# Altium schematic sheet Sensors.SchDoc
size A4; SheetNumber: 2; SheetTotal: 7
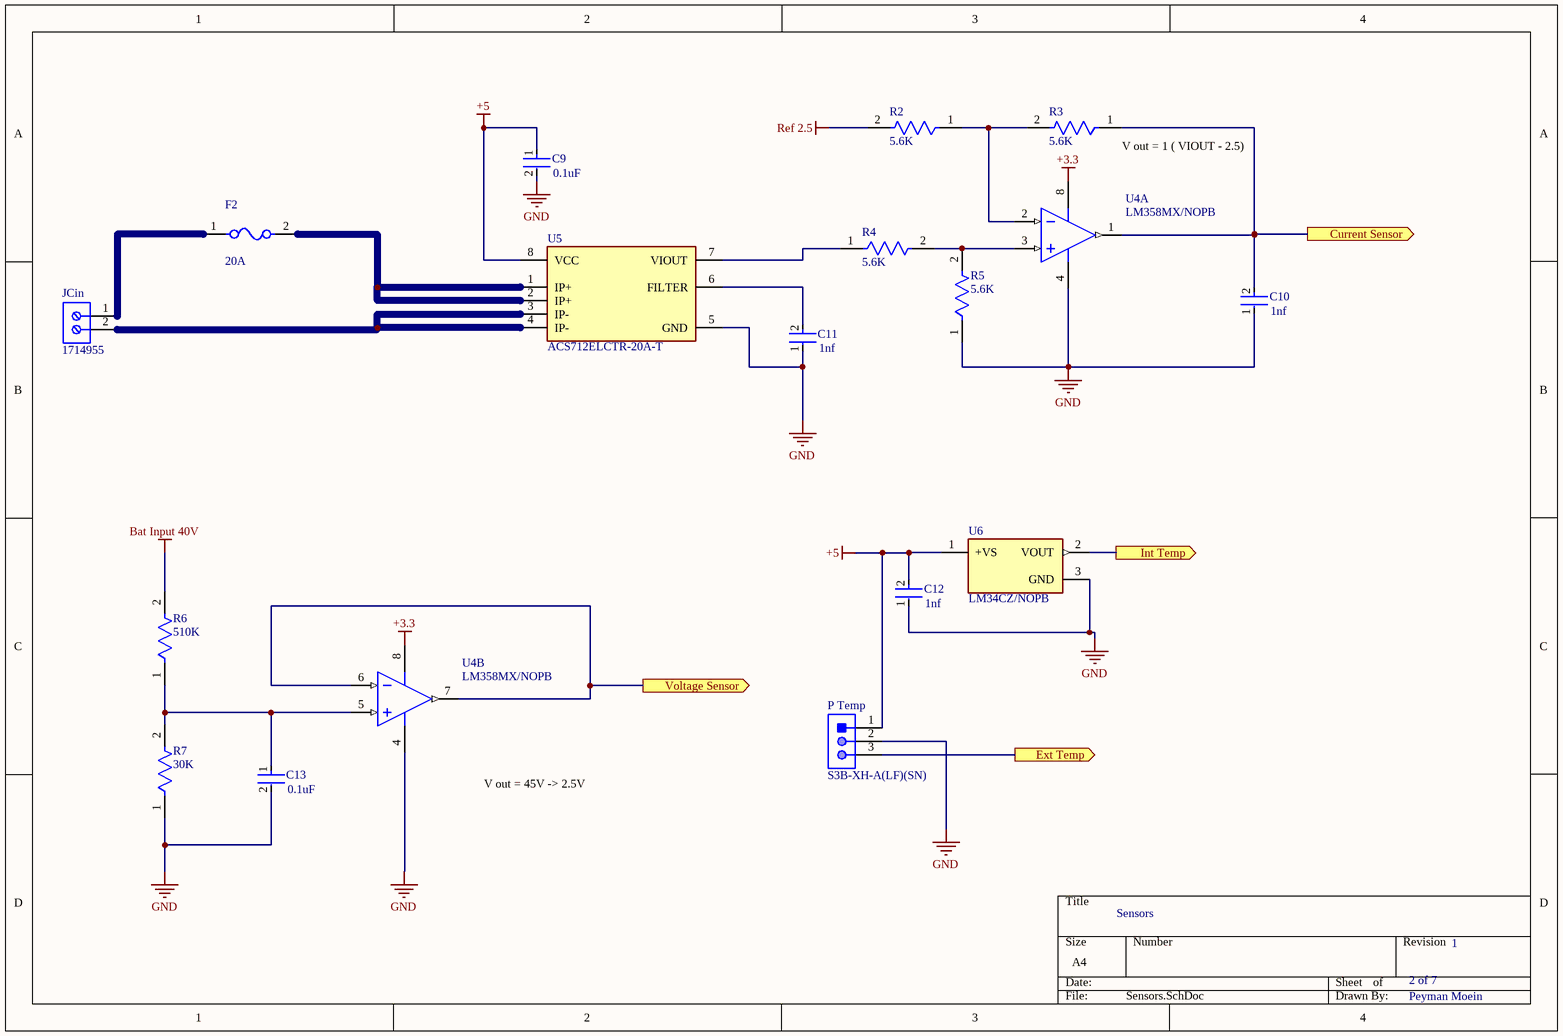
[diagram p0: Sensors.SchDoc]

## Parts
C9  0.1uF  [FP-C0805C-DN-MFG]
C10  1nf  [CAPC2013X70X45NL10T25]
C11  1nf  [CAPC2013X70X45NL10T25]
C12  1nf  [CAPC2013X70X45NL10T25]
C13  0.1uF  [FP-C0805C-DN-MFG]
F2  20A  [FP-0456-MFG]
JCin  1714955  [PHOE-1714955_V]
P_Temp  S3B-XH-A(LF)(SN)  [JST-S3B-XH-A(LF)(SN)_V]
R2  5.6K  [FP-CRCW0805-e3-MFG]
R3  5.6K  [FP-CRCW0805-e3-MFG]
R4  5.6K  [FP-CRCW0805-e3-MFG]
R5  5.6K  [FP-CRCW0805-e3-MFG]
R6  510K  [FP-CRCW0805-e3-MFG]
R7  30K  [FP-CRCW0805-e3-MFG]
U4  LM358MX/NOPB  [D0008A_L]  (parts A,B of 2)
U5  ACS712ELCTR-20A-T  [FP-LC-8-IPC_C]
U6  LM34CZ/NOPB  [FP-LP0003A-MFG]

## Ports
Current Sensor (out), Ext Temp (out), Int Temp (out), Voltage Sensor (out)

## Nets
+3.3: U4.8(V+)
+5: C9.1 C12.2 P_Temp.1 U5.8(VCC) U6.1(+VS)
Bat Input 40V: R6.2
GND: C9.2 C10.1 C11.1 C12.1 C13.2 P_Temp.2 R5.1 R7.1 U4.4(GND/V-) U5.5(GND) U6.3(GND)
Ref 2.5: R2.2
Current Sensor: C10.2 R3.1 U4.1(OUTA) ; port Current Sensor
Ext Temp: P_Temp.3 ; port Ext Temp
Int Temp: U6.2(VOUT) ; port Int Temp
Voltage Sensor: U4.6(-INB) U4.7(OUTB) ; port Voltage Sensor
NetC11_2: C11.2 U5.6(FILTER)
NetC13_1: C13.1 R6.1 R7.2 U4.5(+INB)
NetF2_1: F2.1 JCin.1
NetF2_2: F2.2 U5.1(IP+) U5.2(IP+)
NetJCin_2: JCin.2 U5.3(IP-) U5.4(IP-)
NetR2_1: R2.1 R3.2 U4.2(-INA)
NetR4_1: R4.1 U5.7(VIOUT)
NetR4_2: R4.2 R5.2 U4.3(+INA)

## Notes on the sheet
- (near R3) V out = 1 ( VIOUT - 2.5)
- V out = 45V -> 2.5V
- Sensors
- 2 of 7
- 1
- Peyman Moein

## Library data of the parts
C9 C13 = CMP-2100-03606-3: C49678; Manufacturer Part Number: CC0805KRX7R9BB104; Manufacturer: Yageo; Tolerance: 0.1; Capacitance: 100 nF; Value: 100 nF; Temperature Characteristic: X7R; Voltage Rating: 50 V; Material: Ceramic; Device Class L1: Passive Components; ComponentLink2Description: Datasheet; Package: CC0805-0.85; Digikey Description: CAP CER 0.1UF 50V X7R 0805; Device Class L3: Ceramic Capacitors; Temperature: -30°C to +85°C; Height: 0.95mm; RoHS: TRUE; Ipc Land Pattern Name: CAPC200125X85; Device Class L2: Capacitors; Category: Cap; Temperature Range Low: -30°C; Temperature Range High: +85°C; Mouser Description: Multilayer Ceramic Capacitors MLCC - SMD/SMT 100nF 50V X7R 10%; Footprint Url: http://www.yageo.com/exep/pages/download/literatures/UPY-C_GEN_24.pdf; Automotive: No; Octopart: https://octopart.com/cc0805krx7r9bb104-yageo-192993; Lead Free: Yes; ComponentLink2URL: http://www.yageo.com/documents/recent/UPY-GPHC_Y5V_6.3V-to-50V_8.pdf
C10-C12 = CMP-2100-03606-3: C303890; Manufacturer Part Number: CC0805KRX7R9BB104; Manufacturer: Yageo; Tolerance: 0.1; Capacitance: 100 nF; Value: 100 nF; Temperature Characteristic: X7R; Voltage Rating: 50 V; Material: Ceramic; Device Class L1: Passive Components; ComponentLink2Description: Datasheet; Package: CC0805-0.85; Digikey Description: CAP CER 0.1UF 50V X7R 0805; Device Class L3: Ceramic Capacitors; Temperature: -30°C to +85°C; Height: 0.95mm; RoHS: TRUE; Ipc Land Pattern Name: CAPC200125X85; Device Class L2: Capacitors; Category: Cap; Temperature Range Low: -30°C; Temperature Range High: +85°C; Mouser Description: Multilayer Ceramic Capacitors MLCC - SMD/SMT 100nF 50V X7R 10%; Footprint Url: http://www.yageo.com/exep/pages/download/literatures/UPY-C_GEN_24.pdf; Automotive: No; Octopart: https://octopart.com/cc0805krx7r9bb104-yageo-192993; Lead Free: Yes; ComponentLink2URL: http://www.yageo.com/documents/recent/UPY-GPHC_Y5V_6.3V-to-50V_8.pdf
F2 = CMP-08605-000068-1: C99552; Manufacturer: Littelfuse Inc; Manufacturer Part Number: 0456020.ER; Fuse Interrupt Dc Current: 1000A; Fuse Voltage Drop: 64.7mV; Fuse Interrupt Ac Current: 300A; Fuse I2T: 18A2Sec; Max Fuse Dc Voltage: 100V; Voltage Rating: 125V; Value: 2.3mΩ; Fuse Blow Speed: Fast; RoHS: TRUE; Lead Free: Yes; Temperature Range High: +125°C; Device Class L3: unset; Octopart: https://octopart.com/0456020.er-littelfuse-7502596; Fuse Current: 20A; Digikey Description: FUSE BOARD MNT 20A 125VAC 100VDC; Category: Fuse; Temperature Range Low: -55°C; ComponentLink2URL: https://www.littelfuse.com/~/media/electronics/datasheets/fuses/littelfuse_fuse_456_datasheet.pdf.pdf; Automotive: No; Mouser Description: Surface Mount Fuses 125V 20A V/FA NANO2; Max Fuse Ac Voltage: 125V; Temperature: -55°C to +125°C; Device Class L2: Fuses; Height: 3.05mm; Package: 0456; ComponentLink2Description: Datasheet; Device Class L1: Circuit Protection; Resistance: 2.3mΩ
JCin = CMP-2000-05797-1: PC Terminal Block, Pitch 6.35 mm, 1 x 2 Position, Height 21.5 mm, Tail Lenght 5.1 mm, RoHS, Bulk; Manufacturer: Phoenix Contact; Package Description: PC Terminal Block, Pitch 6.35 mm, 1 x 2 Position, Height 21.5 mm, Tail Lenght 5.1 mm; Datasheet URL: http://media.digikey.com/pdf/Data%20Sheets/Phoenix%20Contact%20PDFs/1714955.pdf; Package Reference: 1714955; Manufacturer URL: http://www.phoenixcontact.com/; Datasheet Version: 02/2010; Mounting Technology: ThroughHole
P_Temp = CMP-1755-00006-1: C157928; Min Supply Voltage: 1 V; Frequency: 1.8 MHz; Channels: 1; Nominal Supply Current: 170 uA; Max Power Dissipation: 1 W; Max Ouput Current: -10 mA; Case\Package: DIP; Max Supply Voltage: 15 V; Min Operating Temperature: 0 degC; Weight: 0.015535 oz; Radiation Hardening: No; ComponentLink1URL: http://www.jst.com/home2.html; PackageReference: S3B-XH-A(LF)(SN); Length: 9.81 mm; Max Operating Temperature: 70 degC; Package Quantity: 50; REACH SVHC: No SVHC; Mount: Through Hole; Pins: 8; Height: 4.57 mm; DatasheetVersion: May-16; ComponentLink1Description: Manufacturer URL; PackageDescription: Male Header, Pitch 2.5 mm, 1 x 3 Position, Height 6.1 mm, Tail Length 3.4 mm; RoHSCompliant: true; Packaging: Rail/Tube; Width: 6.35 mm; ComponentLink2URL: http://www.jst-mfg.com/product/pdf/eng/eXH.pdf; ComponentLink2Description: Datasheet
R2-R5 = CMP-02407-004193-1: C4382; Tolerance: 1%; Resistance: 2.94R; Max Power Dissipation: 125mW; Temperature Coefficient: 100ppm/°C; Voltage Rating: 150V; Case/Package: 0805; Radiation Hardening: No; Width: 0.049inch; Packaging: Tape and Reel; Height: 0.02inch; Case Code (Imperial): 0805; Length: 2mm; Termination: SMD/SMT; Lead Free: Lead Free; Weight: 0.000194oz; Features: Automotive AEC-Q200; Min Operating Temperature: -55°C; Case Code (Metric): 2012; Contact Plating: Tin; Composition: Thick Film; Military Standard: Not; Number of Terminations: 2; Depth: 1.25mm; Package Quantity: 10; Max Operating Temperature: 155°C; Power Rating: 125mW
R6 = CMP-02407-004193-1: C17724; Tolerance: 1%; Resistance: 2.94R; Max Power Dissipation: 125mW; Temperature Coefficient: 100ppm/°C; Voltage Rating: 150V; Case/Package: 0805; Radiation Hardening: No; Width: 0.049inch; Packaging: Tape and Reel; Height: 0.02inch; Case Code (Imperial): 0805; Length: 2mm; Termination: SMD/SMT; Lead Free: Lead Free; Weight: 0.000194oz; Features: Automotive AEC-Q200; Min Operating Temperature: -55°C; Case Code (Metric): 2012; Contact Plating: Tin; Composition: Thick Film; Military Standard: Not; Number of Terminations: 2; Depth: 1.25mm; Package Quantity: 10; Max Operating Temperature: 155°C; Power Rating: 125mW
R7 = CMP-02407-004193-1: C422839; Tolerance: 1%; Resistance: 2.94R; Max Power Dissipation: 125mW; Temperature Coefficient: 100ppm/°C; Voltage Rating: 150V; Case/Package: 0805; Radiation Hardening: No; Width: 0.049inch; Packaging: Tape and Reel; Height: 0.02inch; Case Code (Imperial): 0805; Length: 2mm; Termination: SMD/SMT; Lead Free: Lead Free; Weight: 0.000194oz; Features: Automotive AEC-Q200; Min Operating Temperature: -55°C; Case Code (Metric): 2012; Contact Plating: Tin; Composition: Thick Film; Military Standard: Not; Number of Terminations: 2; Depth: 1.25mm; Package Quantity: 10; Max Operating Temperature: 155°C; Power Rating: 125mW
U4 = CMP-2000-07568-1: C16416; Manufacturer: Texas Instruments; Number of Elements: 2; Gain Bandwidth Product: 1MHz; Voltage Gain: 100dB; Nominal Supply Current: 500uA; Power Dissipation: 530mW; Common Mode Rejection Ratio: 65dB; Operating Supply Voltage: 16V; Input Bias Current: 250nA; Min Supply Voltage: 3V; Slew Rate: 0.1V\/us; Min Dual Supply Voltage: 1.5V; Output Current: 30mA; Max Supply Voltage: 32V; Input Offset Voltage (Vos): 7mV; Case\/Package: SOIC; Package URL: http://www.ti.com/lit/ml/msoi002j/msoi002j.pdf; Number of Amplifiers: 2; RoHSCompliant: True; Manufacturer URL: http://www.ti.com/; Max Operating Temperature: 70degC; Unity Gain Bandwidth Product: 1MHz; Number of Channels: 2; Datasheet Version: Rev. I, 12/2014; Mount: SurfaceMount; Radiation Hardening: No; Package Description: 8-Pin Small Outline Integrated Circuit, Body 4.9 x 3.9 mm, Pitch 1.27 mm; Power Supply Rejection Ratio (PSRR): 65dB; Datasheet URL: http://www.ti.com/lit/ds/symlink/lm358-n.pdf; Packaging: TapeandReel; Max Dual Supply Voltage: 16V; REACH SVHC: NoSVHC; Number of Pins: 8; Number of Circuits: 2; Package Quantity: 2500; Mounting Technology: SurfaceMount; Min Operating Temperature: 0degC; Bandwidth: 1MHz; Package Reference: D0008A; Lead Free: LeadFree
U5 = CMP-0826-00001-2: C10681; Accuracy: 1.5%; Quiescent Current: 10mA; Response Time: 5us; Sensitivity: 100mV/A; Current Sensing: 20A; Min Supply Voltage: 4.5V; Number of Channels: 1; Polarity: Bidirectional; Frequency: 80kHz; Max Supply Current: 13mA; Operating Supply Voltage: 5V; Max Supply Voltage: 5.5V; Max Operating Temperature: 85°C; Case/Package: SOIC; REACH SVHC: No SVHC; Min Operating Temperature: -40°C; Packaging: Tape and Reel; Lead Free: Lead Free; Series: -; Length: 4.9mm; Number of Pins: 8; Linearity: 1.5%; Radiation Hardening: No; Package Quantity: 1; Termination: SMD/SMT; Output Current: 10mA; Height: 1.5mm; RoHS Compliant: Yes; Width: 3.9mm; Bandwidth: 80kHz
U6 = CMP-04948-000010-1: SENSOR ANALOG -40F-230F TO92-3; Manufacturer: Texas Instruments; Sensor Output: Analog Voltage; Operating Supply Current: 75-76uA; Min Supply Voltage: 4V; Output Current: 10mA; Output Voltage: 6V; Max Supply Voltage: 30V; Category: IC; Octopart: https://octopart.com/lm34cz%2Fnopb-texas+instruments-24813949; Temperature Range High: +110°C; Temperature Range Low: -40°C; RoHS: TRUE; Lead Free: Yes; Mouser Description: Board Mount Temperature Sensors PREC FAHRENHEIT TEMP SENSOR; Temperature: -40°C to +110°C; Package: LP0003A; Ambient Temperature Range Low: -40°F; Digikey Description: SENSOR ANALOG -40F-230F TO92-3; ComponentLink2URL: https://www.ti.com/lit/ds/symlink/lm34.pdf; ComponentLink2Description: Datasheet; Device Class L2: Temperature and Humidity Sensors; Device Class L3: unset; Device Class L1: Sensors; Ambient Temperature Range High: +230°F; Manufacturer Part Number: LM34CZ/NOPB; Automotive: No